# Altium schematic sheet MSP430 Main.SchDoc: MSP430 Booster Pack
size B; Date: Not shown in title block; ApprovedBy: Not shown in title block; CheckedBy: Not shown in title block; Author: Not shown in title block; CompanyName: Not shown in title block; Engineer: Logan Greif; Organization: Not shown in title block; Address1: Not shown in title block; Address2: Not shown in title block; Address3: Not shown in title block; Address4: Not shown in title block; DocumentNumber: 1; Revision: Use project parameter SCH_Rev; SheetNumber: 1; SheetTotal: 1; PageSetup: Record=PageOptions|CenterHorizontal=True|CenterVertical=True|PrintScale=1.00|XCorrection=1.00|YCorrection=1.00|PrintKind=0|BorderSize=5000000|LeftOffset=0|BottomOffset=0|Orientation=2|PaperLength=1000|PaperWidth=1000|Scale=100|PaperSource=15|PrintQuality=600|MediaType=1|DitherType=10|PaperKind=Letter|PrintScaleMode=1; CurrentTime: Not shown in title block; CurrentDate: Not shown in title block; Time: Not shown in title block; DocumentFullPathAndName: Not shown in title block; DocumentName: Not shown in title block; ModifiedDate: Not shown in title block; ImagePath: Not shown in title block
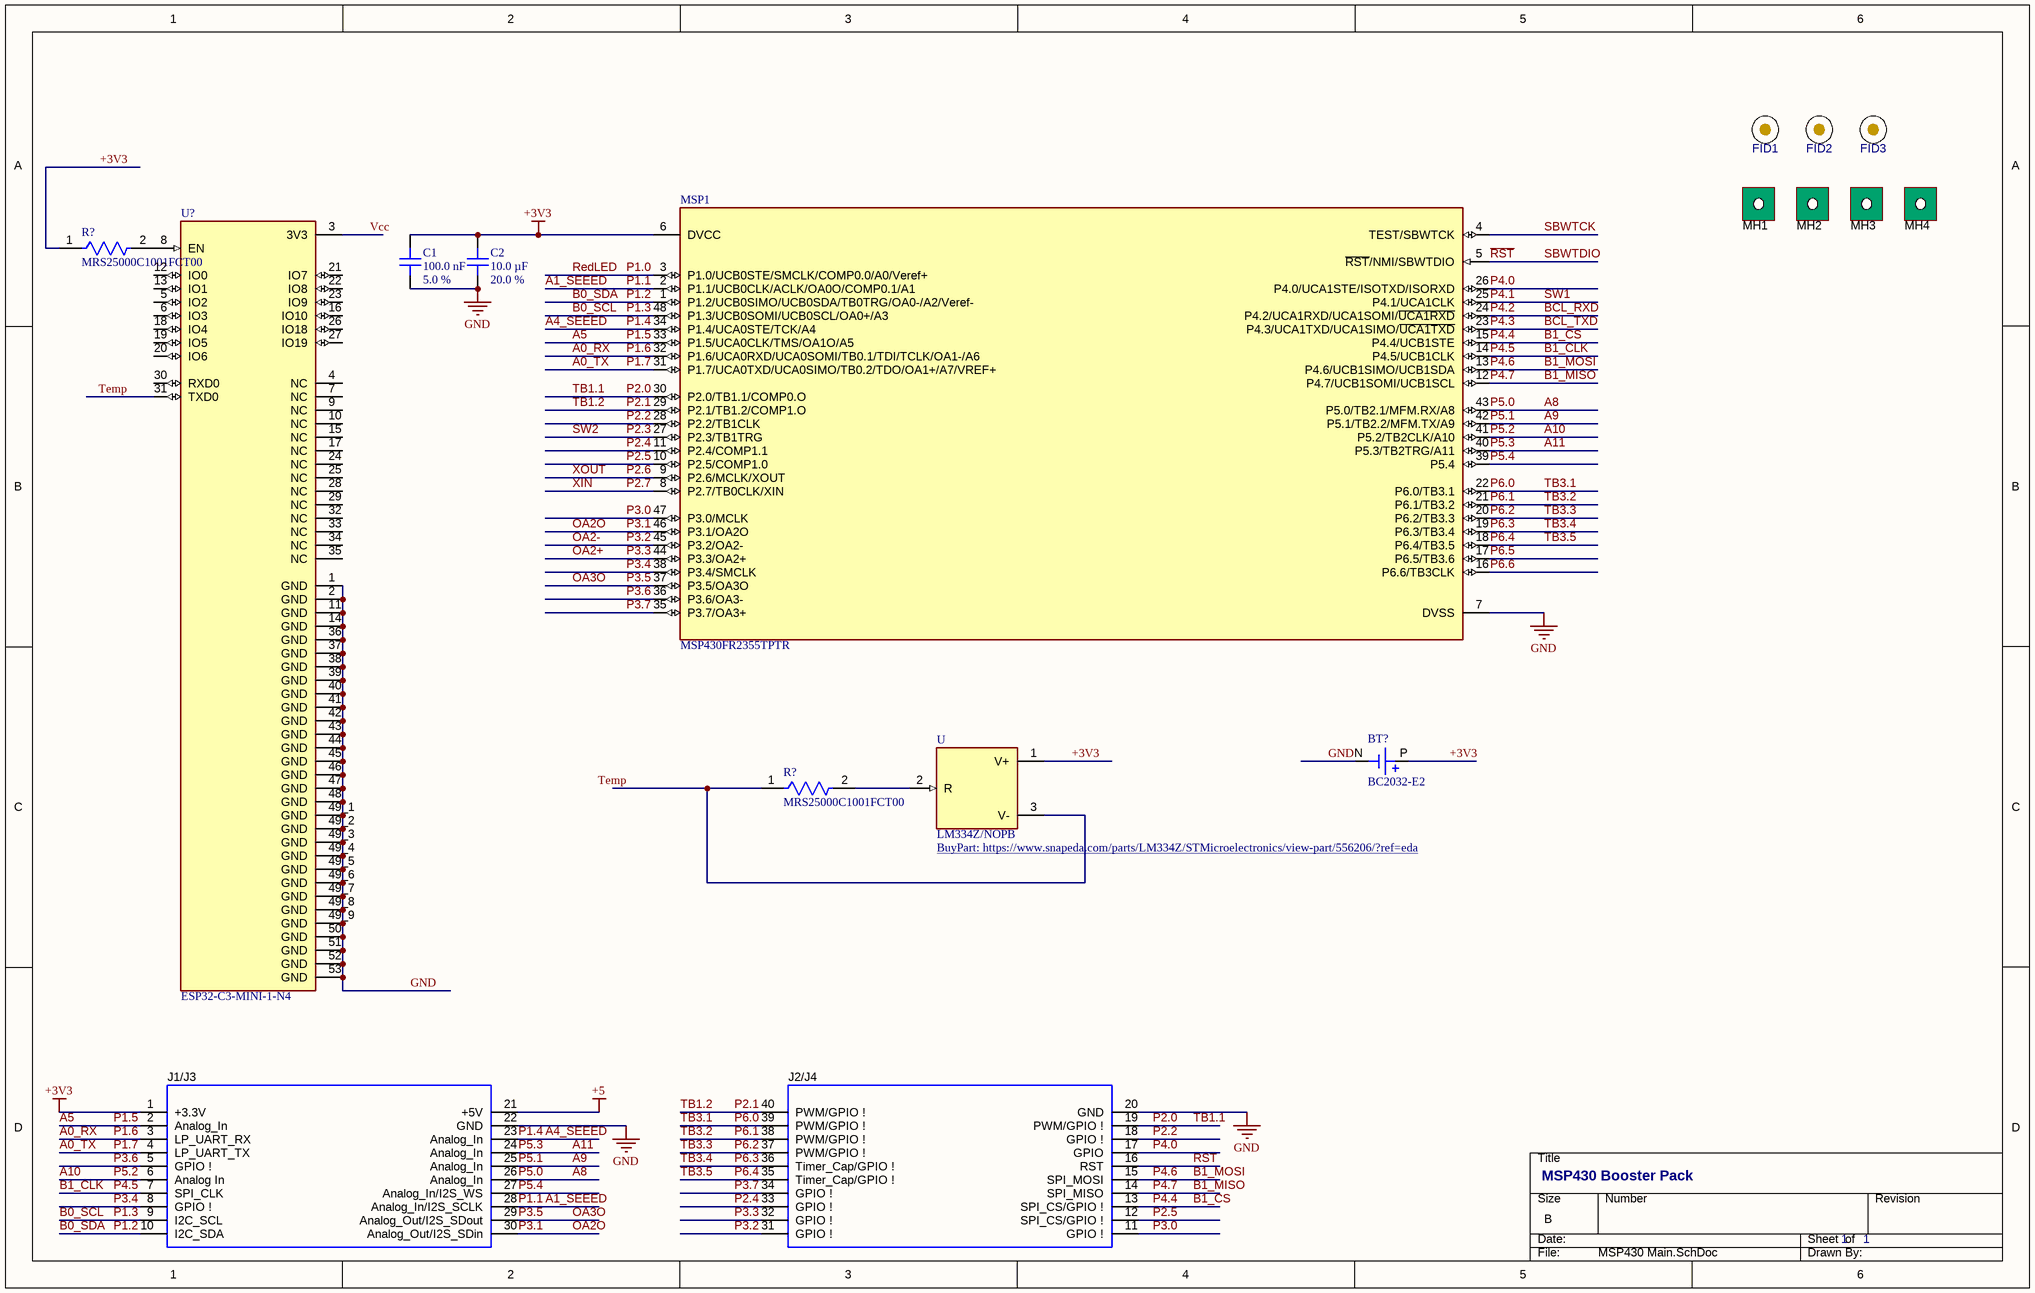
[diagram p0: MSP430 Main.SchDoc]

## Parts
(Parts that share a designator on the sheet are numbered #1, #2 ... from top to bottom, then left to right.)
BT?  BC2032-E2  [MPD_BC2032-E2]
C1  100.0 nF  Tolerance: 5.0 %  [PCB - CAPACITOR - MLCC - CAP 0603_1608]
C2  10.0 µF  Tolerance: 20.0 %  [PCB - CAPACITOR - MLCC - CAP 0603_1608]
FID1  Fiducial  [Fiducial6.4-20]  (value not drawn)
FID2  Fiducial  [Fiducial6.4-20]  (value not drawn)
FID3  Fiducial  [Fiducial6.4-20]  (value not drawn)
J1/J3  SSQ-110-03-T-D  [BoosterPack_40pin_J1J3]  (value not drawn)
J2/J4  SSQ-110-03-T-D  [BoosterPack_40pin_J2J4]  (value not drawn)
MH1  MTG_NoPads  [NPTH125mil]  (value not drawn)  (no BOM)
MH2  MTG_NoPads  [NPTH125mil]  (value not drawn)  (no BOM)
MH3  MTG_NoPads  [NPTH125mil]  (value not drawn)  (no BOM)
MH4  MTG_NoPads  [NPTH125mil]  (value not drawn)  (no BOM)
MSP1  MSP430FR2355TPTR  [FP-PT0048A-MFG]
R?#1  MRS25000C1001FCT00  [FP-MRS25-MFG]
R?#2  MRS25000C1001FCT00  [FP-MRS25-MFG]
U  LM334Z/NOPB  [TO92127P520H660-3]
U?  ESP32-C3-MINI-1-N4  [XCVR_ESP32-C3-MINI-1-N4]

## Nets
+3V3: BT?.P C1.2 C2.2 J1/J3.1(+3.3V) MSP1.6(DVCC) R?#1.1 U.1(V+)
+5: J1/J3.21(+5V)
GND: BT?.N C1.1 C2.1 J1/J3.22(GND) J2/J4.20(GND) MSP1.7(DVSS) U?.1(GND) U?.2(GND) U?.11(GND) U?.14(GND) U?.36(GND) U?.37(GND) U?.38(GND) U?.39(GND) U?.40(GND) U?.41(GND) U?.42(GND) U?.43(GND) U?.44(GND) U?.45(GND) U?.46(GND) U?.47(GND) U?.48(GND) U?.49_1(GND) U?.49_2(GND) U?.49_3(GND) U?.49_4(GND) U?.49_5(GND) U?.49_6(GND) U?.49_7(GND) U?.49_8(GND) U?.49_9(GND) U?.50(GND) U?.51(GND) U?.52(GND) U?.53(GND)
A0_RX: J1/J3.3(LP_UART_RX) MSP1.32(P1.6/UCA0RXD/UCA0SOMI/TB0.1/TDI/TCLK/OA1-/A6)  [also labelled P1.6]
A0_TX: J1/J3.4(LP_UART_TX) MSP1.31(P1.7/UCA0TXD/UCA0SIMO/TB0.2/TDO/OA1+/A7/VREF+)  [also labelled P1.7]
A1_SEEED: J1/J3.28(Analog_In/I2S_SCLK) MSP1.2(P1.1/UCB0CLK/ACLK/OA0O/COMP0.1/A1)  [also labelled P1.1]
A4_SEEED: J1/J3.23(Analog_In) MSP1.34(P1.4/UCA0STE/TCK/A4)  [also labelled P1.4]
A5: J1/J3.2(Analog_In) MSP1.33(P1.5/UCA0CLK/TMS/OA1O/A5)  [also labelled P1.5]
A8: J1/J3.26(Analog_In) MSP1.43(P5.0/TB2.1/MFM.RX/A8)  [also labelled P5.0]
A9: J1/J3.25(Analog_In) MSP1.42(P5.1/TB2.2/MFM.TX/A9)  [also labelled P5.1]
A10: J1/J3.6(Analog_In) MSP1.41(P5.2/TB2CLK/A10)  [also labelled P5.2]
A11: J1/J3.24(Analog_In) MSP1.40(P5.3/TB2TRG/A11)  [also labelled P5.3]
B0_SCL: J1/J3.9(I2C_SCL) MSP1.48(P1.3/UCB0SOMI/UCB0SCL/OA0+/A3)  [also labelled P1.3]
B0_SDA: J1/J3.10(I2C_SDA) MSP1.1(P1.2/UCB0SIMO/UCB0SDA/TB0TRG/OA0-/A2/Veref-)  [also labelled P1.2]
B1_CLK: J1/J3.7(SPI_CLK) MSP1.14(P4.5/UCB1CLK)  [also labelled P4.5]
B1_CS: J2/J4.13(SPI_CS/GPIO_!) MSP1.15(P4.4/UCB1STE)  [also labelled P4.4]
B1_MISO: J2/J4.14(SPI_MISO) MSP1.12(P4.7/UCB1SOMI/UCB1SCL)  [also labelled P4.7]
B1_MOSI: J2/J4.15(SPI_MOSI) MSP1.13(P4.6/UCB1SIMO/UCB1SDA)  [also labelled P4.6]
BCL_RXD: MSP1.24(P4.2/UCA1RXD/UCA1SOMI/~{UCA1RXD})  [also labelled P4.2]
BCL_TXD: MSP1.23(P4.3/UCA1TXD/UCA1SIMO/~{UCA1TXD})  [also labelled P4.3]
OA2+: J2/J4.32(GPIO_!) MSP1.44(P3.3/OA2+)  [also labelled P3.3]
OA2-: J2/J4.31(GPIO_!) MSP1.45(P3.2/OA2-)  [also labelled P3.2]
OA2O: J1/J3.30(Analog_Out/I2S_SDin) MSP1.46(P3.1/OA2O)  [also labelled P3.1]
OA3O: J1/J3.29(Analog_Out/I2S_SDout) MSP1.37(P3.5/OA3O)  [also labelled P3.5]
P1.0: MSP1.3(P1.0/UCB0STE/SMCLK/COMP0.0/A0/Veref+)  [also labelled RedLED]
P2.0: J2/J4.19(PWM/GPIO_!) MSP1.30(P2.0/TB1.1/COMP0.O)  [also labelled TB1.1]
P2.1: J2/J4.40(PWM/GPIO_!) MSP1.29(P2.1/TB1.2/COMP1.O)  [also labelled TB1.2]
P2.2: J2/J4.18(GPIO_!) MSP1.28(P2.2/TB1CLK)
P2.3: MSP1.27(P2.3/TB1TRG)  [also labelled SW2]
P2.4: J2/J4.33(GPIO_!) MSP1.11(P2.4/COMP1.1)
P2.5: J2/J4.12(SPI_CS/GPIO_!) MSP1.10(P2.5/COMP1.0)
P2.6: MSP1.9(P2.6/MCLK/XOUT)  [also labelled XOUT]
P2.7: MSP1.8(P2.7/TB0CLK/XIN)  [also labelled XIN]
P3.0: J2/J4.11(GPIO_!) MSP1.47(P3.0/MCLK)
P3.4: J1/J3.8(GPIO_!) MSP1.38(P3.4/SMCLK)
P3.6: J1/J3.5(GPIO_!) MSP1.36(P3.6/OA3-)
P3.7: J2/J4.34(GPIO_!) MSP1.35(P3.7/OA3+)
P4.0: J2/J4.17(GPIO) MSP1.26(P4.0/UCA1STE/ISOTXD/ISORXD)
P4.1: MSP1.25(P4.1/UCA1CLK)  [also labelled SW1]
P5.4: J1/J3.27(Analog_In/I2S_WS) MSP1.39(P5.4)
P6.0: J2/J4.39(PWM/GPIO_!) MSP1.22(P6.0/TB3.1)  [also labelled TB3.1]
P6.1: J2/J4.38(PWM/GPIO_!) MSP1.21(P6.1/TB3.2)  [also labelled TB3.2]
P6.2: J2/J4.37(PWM/GPIO_!) MSP1.20(P6.2/TB3.3)  [also labelled TB3.3]
P6.3: J2/J4.36(Timer_Cap/GPIO_!) MSP1.19(P6.3/TB3.4)  [also labelled TB3.4]
P6.4: J2/J4.35(Timer_Cap/GPIO_!) MSP1.18(P6.4/TB3.5)  [also labelled TB3.5]
P6.5: MSP1.17(P6.5/TB3.6)
P6.6: MSP1.16(P6.6/TB3CLK)
~{RST}: J2/J4.16(RST) MSP1.5(~{RST}/NMI/SBWTDIO)  [also labelled SBWTDIO]
SBWTCK: MSP1.4(TEST/SBWTCK)
Temp: R?#2.1 U.3(V-) U?.31(TXD0)
Vcc: U?.3(3V3)
NetR?#1_2: R?#1.2 U?.8(EN)
NetR?#2_2: R?#2.2 U.2(R)

Not connected (* = marked no-connect by the designer): U? 4(NC) 5(IO2) 6(IO3) 7(NC) 9(NC) 10(NC) 12(IO0) 13(IO1) 15(NC) 16(IO10) 17(NC) 18(IO4) 19(IO5) 20(IO6) 21(IO7) 22(IO8) 23(IO9) 24(NC) 25(NC) 26(IO18) 27(IO19) 28(NC) 29(NC) 30(RXD0) 32(NC) 33(NC) 34(NC) 35(NC)

## Notes on the sheet
- DWG. NO.
- REV.
- SHT.
- REVISION
- DESCRIPTION
- DATE
- APPROVED
- THIS DOCUMENT AND THE DATA DISCLOSED HEREIN OR HEREWITH IS THE PROPERTY OF ALTIUM LIMITED AND MAY BE FREELY DISTRIBUTED IN WHOLE. NO RIGHTS ARE RESERVED OR EXPRESS OR IMPLIED WARANTEE GIVEN.
- ENG:
- DSN:
- APPROVALS
- PROJECT
- DOCUMENT REVISION:
- DESIGN ITEM:
- CHK:
- BOM:
- REFERENCE DOCUMENTS
- PROJECT REVISION:
- TITLE
- FAB DWG:
- PCB DWG:
- ASSY DWG:
- SCALE:
- SIZE
- C
- CAGE CODE
- FILE NAME
- DWG NO.
- SHEET
- OF
- REV

## Library data of the parts
BT? = CMP-00029-00001-1: Battery Holder (Open) Coin, 20.0mm 1 Cell PC Pin; MF: MPD (Memory; SnapEDA_Link: https://www.snapeda.com/parts/BC2032-E2/Memory+Protection+Devices/view-part/?ref=snap; Pins: 2; Check_prices: https://www.snapeda.com/parts/BC2032-E2/Memory+Protection+Devices/view-part/?ref=eda; Design Item ID: BC2032-E2; Case/Package: DFN-8 MPD; Digi-Key_Part_Number: BC2032-E2-ND; Purchase-URL: https://pricing.snapeda.com/search/part/BC2032-E2/?ref=eda; Component Type: Standard; Value: *; MP: BC2032-E2; Source: BC2032-E2.SchLib
C1 = 1564: 0.1 µF ±5% 50V Ceramic Capacitor X7R 0603 (1608 Metric); Rowan Part Number: 1564; Manufacturer: YAGEO; Manufacturer part number: CC0603JRX7R9BB104; Name: 100.0 nF 50.0 V 5.0 % Ceramic Capacitor; Voltage Rating: 50.0 V; Supplier 1: Digi-Key; Supplier Part Number 1: 311-1779-2-ND; Category: Capacitors; Datasheet: https://www.yageo.com/upload/media/product/productsearch/datasheet/mlcc/UPY-GPHC_X7R_6.3V-to-50V_20.pdf; Status: Active; Package: 0603 (1608 Metric); Packaging: Tape & Reel (TR); Capacitance: 100.0 nF; Composition: Ceramic
C2 = 1572: 10 µF ±20% 16V Ceramic Capacitor X5R 0603 (1608 Metric); Rowan Part Number: 1572; Manufacturer: YAGEO; Manufacturer part number: CC0603MRX5R7BB106; Name: 10.0 µF 16.0 V 20.0 % Ceramic Capacitor; Voltage Rating: 16.0 V; Supplier 1: Digi-Key; Supplier Part Number 1: 311-1822-2-ND; Category: Capacitors; Datasheet: https://www.yageo.com/upload/media/product/productsearch/datasheet/mlcc/UPY-GPHC_X5R_4V-to-50V_26.pdf; Status: Active; Package: 0603 (1608 Metric); Packaging: Tape & Reel (TR); Capacitance: 10.0 µF; Composition: Ceramic
FID1-FID3 = Fiducial: Fiducial mark.  There is nothing to buy or mount.; SymbolCreator: codlsc; SymbolVersion: 2009-11-4; CompType: Fiducial; PackageReference: N/A; ClassName: FiducialMark; Manufacturer: N/A; PartNumber: N/A; MountType: N/A; Publisher: Texas Instruments; LatestRevisionDate: 2017-05-31; LatestRevisionNote: Added Alternate PartNumber and Alternate Manufacturer parameters to appropriate components.
J1/J3 = BoosterPack_40pin_J1J3: Receptacle, 2.54mm, 10x2, Tin, TH; Manufacturer: Samtec; Alternate Manufacturer: Major League Electronics; Alternate PartNumber: CRD-081413-A-G; SymbolCreator: a0412235; Note: Booster Pack 40 pin J1 and J3; SymbolVersion: 2015-10-21; CompType: Receptacle; PartNumber: SSQ-110-03-T-D; RoHS: Y; PackageReference: 10x2 Receptacle; MountType: TH; ComponentLink1Description: Datasheet Link; Publisher: Texas Instruments; LatestRevisionDate: 2017-02-01; Supplier 1: Digi-Key; Supplier Part Number 1: SAM1204-10-ND
J2/J4 = BoosterPack_40pin_J2J4: Receptacle, 2.54mm, 10x2, Tin, TH; Manufacturer: Samtec; Alternate Manufacturer: Major League Electronics; Alternate PartNumber: CRD-081413-A-G; SymbolCreator: a0412235; Note: Booster Pack 40 pin J2 and J4; SymbolVersion: 2015-10-21; CompType: Receptacle; PartNumber: SSQ-110-03-T-D; RoHS: Y; PackageReference: 10x2 Receptacle; MountType: TH; ComponentLink1Description: Datasheet Link; Publisher: Texas Instruments; LatestRevisionDate: 2017-02-01; Supplier 1: Digi-Key; Supplier Part Number 1: SAM1204-10-ND
MH1-MH4 = Mounting Hole (non-standard) No Pad: PCB Mounting Hole, No Pad; Manufacturer: Any; SymbolCreator: a0412235; SymbolVersion: 2013-12-26; CompType: Mounting Hole; PartNumber: N/A; PackageReference: Mounting Hole; MountType: N/A; Publisher: Texas Instruments; LatestRevisionDate: 2017-01-25
MSP1 = CMP-04869-000010-1: IC MCU 16BIT 32KB FRAM 48LQFP; Manufacturer: Texas Instruments; Frequency: 24MHz; Ram Size: 4KBytes; Memory Type: OTHER; Max Junction Temp: +115°C; Standoff Height: 0.05mm; Data Bus Width: 16bits; Number Of Uart Channels: 2; Number Of Cores: 1; Memory Size: 32KBytes; Core Architecture: RISC; Number Of Spi Channels: 4; Max Supply Voltage: 3.6V; Number Of I/Os: 44; Interface: I2C,SPI,UART,USART,SCI,IrDA; Min Supply Voltage: 1.8V; Number Of Adc Channels: 12; Ipc Land Pattern Name: QFP50P900X900X160-48; Lead Free: Yes; Device Class L1: Integrated Circuits (ICs); Digikey Description: IC MCU 16BIT 32KB FRAM 48LQFP; Manufacturer Part Number: MSP430FR2355TPTR; Height: 1.6mm; Number Of Timers/Counters: 4; RoHS: TRUE; Temperature Range High: +105°C; Temperature: -40°C to +105°C; Temperature Range Low: -40°C; Automotive: No; Number Of A/D Converters: 1; Device Class L3: Microcontrollers; ComponentLink2URL: http://www.ti.com/lit/ds/symlink/msp430fr2355.pdf; Octopart: https://octopart.com/msp430fr2355tptr-texas+instruments-92191342; Device Class L2: Embedded Processors and Controllers; Package: PT0048A; Ambient Temperature Range Low: -40°C; Category: IC; Footprint Url: http://www.ti.com/lit/ds/symlink/tl16c550c.pdf; Ambient Temperature Range High: +105°C; Number Of I2C Channels: 2; ComponentLink2Description: Datasheet
R?#1 R?#2 = CMP-02408-000051-1: RES 1K OHM 0.6W 1% AXIAL; Power Rating: 600mW; Lead Diameter: 0.6mm; Voltage Rating (DC): 350V; Resistance: 1kR; Temperature Coefficient: 50ppm/°C; Width: 2.5mm; Military Standard: Not; Package Quantity: 5000; Radiation Hardening: No; Case/Package: Axial; Resistance Tolerance: 1%; Resistor Type: Metal Film; Contact Plating: Tin; Length: 6.5mm; Lead Free: Lead Free; RoHS Compliant: Yes; Mount: Through Hole; Number of Pins: 2; Technology: THIN FILM; Voltage Rating: 350V; Min Operating Temperature: -55°C; Weight: 0.00776oz; Diameter: 2.5mm; Construction: Cylindrical; Series: MRS25; Tolerance: 1%; Packaging: Tape and Reel; Max Operating Temperature: 155°C; Max Power Dissipation: 600mW; Number of Terminations: 2; Termination: Axial
U = CMP-002-000003-1: Current Source Regulator 10mA TO-92-3; MF: STMicroelectronics; MP: LM334Z; BuyPart: https://www.snapeda.com/parts/LM334Z/STMicroelectronics/view-part/556206/?ref=eda; Value: *; SnapEDA_Link: https://www.snapeda.com/parts/LM334Z/STMicroelectronics/view-part/556206/?ref=snap; Pin Count: 3; Source: LM334Z_NOPB.SchLib; Package: TO-92 STMicroelectronics; Price: None; Component Type: Standard; Availability: Bad; Design Item ID: LM334Z/NOPB
U? = CMP-006-000000-1: Bluetooth, WiFi 802.11b/g/n, Bluetooth v5.0 Transceiver Module 2.412GHz ~ 2.484GHz PCB Trace Surface Mount; MF: Espressif Systems; MP: ESP32-C3-MINI-1-N4; Price: None; Check_prices: https://www.snapeda.com/parts/ESP32-C3-MINI-1-N4/Espressif+Systems/view-part/?ref=eda; Pin Count: 61; Component Type: Standard; Value: *; SnapEDA_Link: https://www.snapeda.com/parts/ESP32-C3-MINI-1-N4/Espressif+Systems/view-part/?ref=snap; Purchase-URL: https://pricing.snapeda.com/search/part/ESP32-C3-MINI-1-N4/?ref=eda; Availability: In Stock; Package: SMD-53 Espressif Systems; Source: ESP32-C3-MINI-1-N4.SchLib; Design Item ID: ESP32-C3-MINI-1-N4